# EAGLE design device_board (EAGLE 7.7.0)
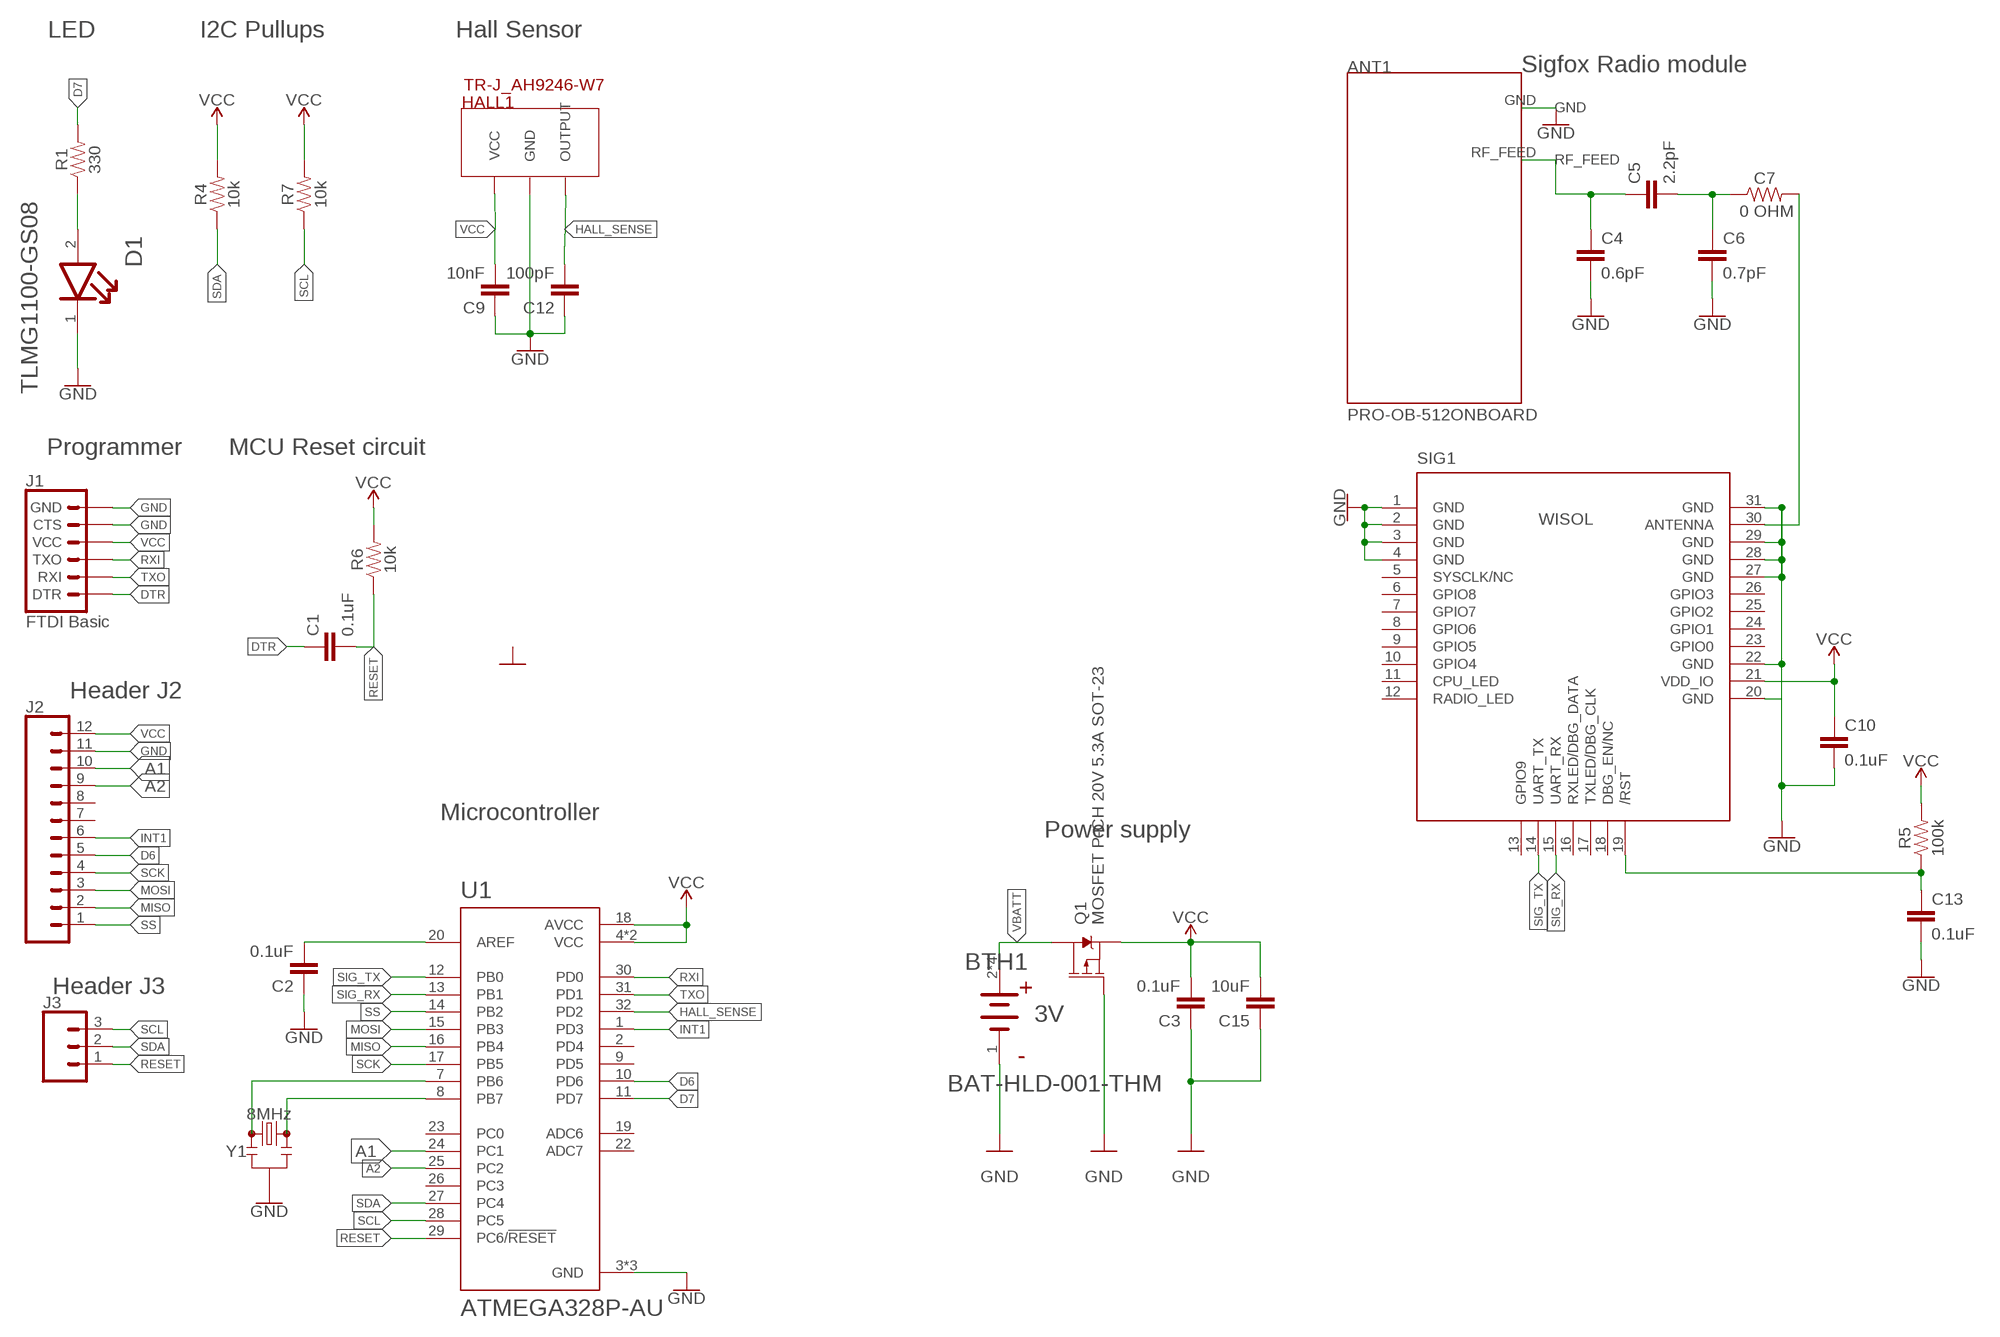
[diagram p0: schematic, sheet 1]

## Parts
ANT1  PRO-OB-512ONBOARD  [ONBOARD_SMD_2400]
BTH1  LINX_BAT-HLD-001-THMLINX_BAT-HLD-001-THM_0_0  [LINX_BAT-HLD-001-THM_0]
C1  0.1uF  0.1UF-0603-25V-5%  [0603]
C2  0.1uF  0.1UF-0603-25V-5%  [0603]
C3  0.1uF  0.1UF-0603-25V-5%  [0603]
C4  0.6pF  0.8PF-0402-50V-0.1PF  [0402]
C5  2.2pF  0.8PF-0402-50V-0.1PF  [0402]
C6  0.7pF  0.8PF-0402-50V-0.1PF  [0402]
C7  0 OHM  RESISTOR0402  [0402]
C9  10nF  10NF-0603-50V-10%  [0603]
C10  0.1uF  0.1UF-0603-25V-(+80/-20%)  [0603]
C12  100pF  100PF-0603-50V-5%  [0603]
C13  0.1uF  0.1UF-0603-25V-(+80/-20%)  [0603]
C15  10uF  10UF-0603-6.3V-20%  [0603]
D1  VISHAY_TLMG1100-GS08VISHAY_TLMG1100-GS08_0_0  [VISHAY_TLMG1100-GS08_0]
HALL1  TR-J_AH9246-W7  [TR-J_SC-59]
J1  FTDI Basic  6_PIN_SERIAL_TARGET  [1X06]
J2  CONN_12  [1X12]
J3  CONN_03  [1X03]
Q1  MOSFET P-CH 20V 5.3A SOT-23  MOSFET_PCHSI2323DDS  [SOT23-3]
R1  330  330OHM-0603-1/10W-1%  [0603]
R4  10k  10KOHM-0603-1/10W-1%  [0603]
R5  100k  100KOHM-0603-1/10W-1%  [0603]
R6  10k  10KOHM-0603-1/10W-1%  [0603]
R7  10k  10KOHM-0603-1/10W-1%  [0603]
SIG1  WISOL_WSSFM10HANDSOLDER  [WISOL_WSSFM10]
U1  ATMEGA328P-AU  [QFP80P900X900X120-32N]
Y1  8MHz  RESONATOR-8MHZSMD_3.2X1.3  [RESONATOR-SMD-3.2X1.3]

## Nets
A1: J2.10 U1.24(PC1)
A2: J2.9 U1.25(PC2)
D6: J2.5 U1.10(PD6)
D7: R1.2 U1.11(PD7)
DTR: C1.1 J1.1(DTR)
GND: ANT1.GND BTH1.1(CATHODE) C2.1 C3.1 C4.2 C6.2 C9.1 C10.2 C12.1 C13.2 C15.1 D1.1(CATHODE) HALL1.3(GND) J1.5(CTS) J1.6(GND) J2.11 Q1.1(G) SIG1.1(GND) SIG1.2(GND) SIG1.3(GND) SIG1.4(GND) SIG1.20(GND) SIG1.22(GND) SIG1.27(GND) SIG1.28(GND) SIG1.29(GND) SIG1.31(GND) U1.3(GND) U1.5(GND) U1.21(GND) Y1.2
HALL_SENSE: C12.2 HALL1.2(OUTPUT) U1.32(PD2)
INT1: J2.6 U1.1(PD3)
MISO: J2.2 U1.16(PB4)
MOSI: J2.3 U1.15(PB3)
N$1: C2.2 U1.20(AREF)
N$2: U1.7(PB6) Y1.1
N$3: U1.8(PB7) Y1.3
N$5: C13.1 R5.1 SIG1.19(/RST)
N$6: C7.2 SIG1.30(ANTENNA)
N$7: C5.2 C6.1 C7.1
N$9: ANT1.RF_FEED C4.1 C5.1
N$19: D1.2(ANODE) R1.1
RESET: C1.2 J3.1 R6.1 U1.29(PC6/!RESET)
RXI: J1.3(TXO) U1.30(PD0)
SCK: J2.4 U1.17(PB5)
SCL: J3.3 R7.1 U1.28(PC5)
SDA: J3.2 R4.1 U1.27(PC4)
SIG_RX: SIG1.15(UART_RX) U1.13(PB1)
SIG_TX: SIG1.14(UART_TX) U1.12(PB0)
SS: J2.1 U1.14(PB2)
TXO: J1.2(RXI) U1.31(PD1)
VBATT: BTH1.2(ANODE) BTH1.2-2(ANODE) BTH1.2-3(ANODE) BTH1.2-4(ANODE) Q1.3(D)
VCC: C3.2 C9.2 C10.1 C15.2 HALL1.1(VCC) J1.4(VCC) J2.12 Q1.2(S) R4.2 R5.2 R6.2 R7.2 SIG1.21(VDD_IO) U1.4(VCC) U1.6(VCC) U1.18(AVCC)
Unconnected: J2.7 J2.8 SIG1.5(SYSCLK/NC) SIG1.6(GPIO8) SIG1.7(GPIO7) SIG1.8(GPIO6) SIG1.9(GPIO5) SIG1.10(GPIO4) SIG1.11(CPU_LED) SIG1.12(RADIO_LED) SIG1.13(GPIO9) SIG1.16(RXLED/DBG_DATA) SIG1.17(TXLED/DBG_CLK) SIG1.18(DBG_EN/NC) SIG1.23(GPIO0) SIG1.24(GPIO1) SIG1.25(GPIO2) SIG1.26(GPIO3) U1.2(PD4) U1.9(PD5) U1.19(ADC6) U1.22(ADC7) U1.23(PC0) U1.26(PC3)

## Notes on the sheet
- LED | Hall Sensor
- I2C Pullups
- Sigfox Radio module
- Programmer | MCU Reset circuit
- Header J2
- Microcontroller
- Power supply
- Header J3

## Library data of the parts
ANT1 = proant:PRO-OB-512: Proant OnBoard Antenna PRO-OB-512 for 848/2400MHz comms (e.g. SigFox)
BTH1 = Linx - BAT-HLD-001-THM:LINX_BAT-HLD-001-THM: RETAINER BATT CR2025/2032 PC PIN; CENTROID_NOT_SPECIFIED: No; DATASHEET: https://www.linxtechnologies.com/wp/wp-content/uploads/bat-hld-001-thm.pdf; DIGIKEY_DESCRIPTION: BATT RETAINER BATT CR2025/2032 PC PIN; DIGIKEY_PART_NUMBER: BAT-HLD-001-THM-ND; LEAD_FREE: yes; MF: Linx; MFG_PACKAGE_IDENT: BAT-HLD-001-THM; MOUSER_PART_NUMBER: 712-BAT-HLD-001-THM; MPN: BAT-HLD-001-THM; PACKAGE: BT-HOLDER; PREFIX: BT; ROHS: yes; VOLTAGE: 3V
C1-C3 = SparkFun-Capacitors:0.1UF: 0.1µF ceramic capacitors A capacitor is a passive two-terminal electrical component used to store electrical energy temporarily in an electric field.; PROD_ID: CAP-08604
C4-C6 = SparkFun-Capacitors:0.8PF: 0.8pF ceramic capacitors A capacitor is a passive two-terminal electrical component used to store electrical energy temporarily in an electric field.; PROD_ID: CAP-13456; VALUE: 0.8pF
C7 = SparkFun-Resistors:RESISTOR: Generic Resistor Package
C9 = SparkFun-Capacitors:10NF: 0.01uF/10nF/10,000pF ceramic capacitors A capacitor is a passive two-terminal electrical component used to store electrical energy temporarily in an electric field. CAP-09321; PROD_ID: CAP-00867
C10 C13 = SparkFun-Capacitors:0.1UF: 0.1µF ceramic capacitors A capacitor is a passive two-terminal electrical component used to store electrical energy temporarily in an electric field.; PROD_ID: CAP-00810
C12 = SparkFun-Capacitors:100PF: 100pF/0.1nF ceramic capacitors A capacitor is a passive two-terminal electrical component used to store electrical energy temporarily in an electric field.; PROD_ID: CAP-07883
C15 = SparkFun-Capacitors:10UF: 10.0µF ceramic capacitors A capacitor is a passive two-terminal electrical component used to store electrical energy temporarily in an electric field.; PROD_ID: CAP-11015
D1 = Vishay - TLMG1100-GS08:VISHAY_TLMG1100-GS08: LED GREEN 0603 SMD; CENTROID_NOT_SPECIFIED: No; COLOUR: Green; DATASHEET: http://www.vishay.com/docs/83173/tlmb1100.pdf; DEVICE_CLASS_L1: Optoelectronics; DEVICE_CLASS_L2: LEDs; DEVICE_CLASS_L3: unset; DIGIKEY_DESCRIPTION: DIODE LED GREEN 0603 SMD; DIGIKEY_PART_NUMBER: 751-1165-1-ND; FORWARD_CURRENT: 30mA; FORWARD_VOLTAGE: 2.1V; HEIGHT: 0.65mm; LEAD_FREE: yes; LED_ORIENTATION: Top View; LUMINOUS_INTENSITY: 35mcd; MAX_JUNCTION_TEMP: +120°C; MF: Vishay; MFG_PACKAGE_IDENT: TLMG0603; MFG_PACKAGE_IDENT_DATE: 0; MFG_PACKAGE_IDENT_REV: 0; MOUSER_DESCRIPTION: Standard LEDs - SMD Green Non-Diffused; MOUSER_PART_NUMBER: 78-TLMG1100; MPN: TLMG1100-GS08; PACKAGE: 0603; POWER_DISSIPATION: 90mW; PREFIX: D; REVERSE_VOLTAGE: 6V; ROHS: yes; TEMPERATURE_RANGE_HIGH: +100°C; TEMPERATURE_RANGE_LOW: -40°C; VERIFICATION_VERSION: 0.0.0.1; VIEWING_ANGLE: 160°; WAVELENGTH: 570nm
HALL1 = Siguino:TR-J_AH9246-W7: Hall effect switch, surface mount, part number AH9246-W-7
J1 = SparkFun-Connectors:6_PIN_SERIAL_TARGET: 6-pin header connection for use with the "FTDI BASIC" pinout - TARGET SIDE. Also known as "Arduino Serial Program Header". It is used to mate with our FTDI Basic serial programmers using the Arduino IDE. Note, this device has "TARGET" in the name. It is intended to be used on a design that contains a target micro-controller that you wish to program. The "sister" device, named "CABLE" is inteneded to be used on a design that usually lives on the end of your USB cable and prvides the converter chip (FTDI232 or FTDI231x) to commnicate serial RX/TX. You can populate with some of these: Break Away Headers - Straight <https://www.sparkfun.com/products/116> (PRT-00116) For reference (or to suit your programming needs) check out these designs: SparkFun FTDI Basic Breakout - 5V <https://www.sparkfun.com/products/9716> (DEV-09716) SparkFun FTDI Basic Breakout - 3.3V <https://www.sparkfun.com/products/9873> (DEV-09873) SparkFun FTDI SmartBasic <https://www.sparkfun.com/products/12935> (DEV-12935) SparkFun Beefy 3 - FTDI Basic Breakout <https://www.sparkfun.com/products/13746> (DEV-13746)
J2 = SparkFun-Connectors:CONN_12: Multi connection point. Often used as Generic Header-pin footprint for 0.1 inch spaced/style header connections On any of the 0.1 inch spaced packages, you can populate with these: Break Away Headers - Straight <https://www.sparkfun.com/products/116> (PRT-00116) Break Away Male Headers - Right Angle <https://www.sparkfun.com/products/553> (PRT-00553) Female Headers <https://www.sparkfun.com/products/115> (PRT-00115) Break Away Headers - Machine Pin <https://www.sparkfun.com/products/117> (PRT-00117) Break Away Female Headers - Swiss Machine Pin <https://www.sparkfun.com/products/743> (PRT-00743) For SCREWTERMINALS and SPRING TERMINALS visit here: Screw Terimnals on SparkFun.com <https://www.sparkfun.com/search/results?term=Screw+Terminals> (5mm/3.5mm/2.54mm spacing) This device is also useful as a general connection point to wire up your design to another part of your project. Our various solder wires solder well into these plated through hole pads. Hook-Up Wire - Assortment (Stranded, 22 AWG) <https://www.sparkfun.com/products/11375> (PRT-11375) Hook-Up Wire - Assortment (Solid Core, 22 AWG) <https://www.sparkfun.com/products/11367> (PRT-11367) View the entire wire category on our website here <https://www.sparkfun.com/categories/141> Special notes: Molex polarized connector foot print use with SKU : PRT-08231 with associated crimp pins and housings. 1MM SMD Version SKU: PRT-10208 NOTES ON THE VARIANTS LOCK and LOCK_LONGPADS... This footprint was designed to help hold the alignment of a through-hole component (i.e. 6-pin header) while soldering it into place. You may notice that each hole has been shifted either up or down by 0.005 of an inch from it's more standard position (which is a perfectly straight line). This slight alteration caused the pins (the squares in the middle) to touch the edges of the holes. Because they are alternating, it causes a "brace" to hold the component in place. 0.005 has proven to be the perfect amount of "off-center" position when using our standard breakaway headers. Although looks a little odd when you look at the bare footprint, once you have a header in there, the alteration is very hard to notice. Also,if you push a header all the way into place, it is covered up entirely on the bottom side.
J3 = SparkFun-Connectors:CONN_03: Multi connection point. Often used as Generic Header-pin footprint for 0.1 inch spaced/style header connections On any of the 0.1 inch spaced packages, you can populate with these: Break Away Headers - Straight <https://www.sparkfun.com/products/116> (PRT-00116) Break Away Male Headers - Right Angle <https://www.sparkfun.com/products/553> (PRT-00553) Female Headers <https://www.sparkfun.com/products/115> (PRT-00115) Break Away Headers - Machine Pin <https://www.sparkfun.com/products/117> (PRT-00117) Break Away Female Headers - Swiss Machine Pin <https://www.sparkfun.com/products/743> (PRT-00743) Stackable Header - 3 Pin (Female, 0.1") <https://www.sparkfun.com/products/13875> (PRT-13875) For SCREWTERMINALS and SPRING TERMINALS visit here: Screw Terimnals on SparkFun.com <https://www.sparkfun.com/search/results?term=Screw+Terminals> (5mm/3.5mm/2.54mm spacing) This device is also useful as a general connection point to wire up your design to another part of your project. Our various solder wires solder well into these plated through hole pads. Hook-Up Wire - Assortment (Stranded, 22 AWG) <https://www.sparkfun.com/products/11375> (PRT-11375) Hook-Up Wire - Assortment (Solid Core, 22 AWG) <https://www.sparkfun.com/products/11367> (PRT-11367) View the entire wire category on our website here <https://www.sparkfun.com/categories/141> Special notes: Molex polarized connector foot print use with SKU : PRT-08232 with associated crimp pins and housings.
Q1 = SparkFun-DiscreteSemi:MOSFET_PCH: P-channel MOSFETs Voltage controlled devices that allow control of high current outputs E.g. See Digikey Product here: SI2323DDS-T1-GE3 <https://www.digikey.ie/product-detail/en/vishay-siliconix/SI2323DDS-T1-GE3/SI2323DDS-T1-GE3CT-ND/4142086>; PROD_ID: SI2323DDS-T1-GE3
R1 = SparkFun-Resistors:330OHM: 330Ω resistor A resistor is a passive two-terminal electrical component that implements electrical resistance as a circuit element. Resistors act to reduce current flow, and, at the same time, act to lower voltage levels within circuits. - Wikipedia; PROD_ID: RES-00818
R4 R6 R7 = SparkFun-Resistors:10KOHM: 10kΩ resistor A resistor is a passive two-terminal electrical component that implements electrical resistance as a circuit element. Resistors act to reduce current flow, and, at the same time, act to lower voltage levels within circuits. - Wikipedia; PROD_ID: RES-00824
R5 = SparkFun-Resistors:100KOHM: 100kΩ resistor A resistor is a passive two-terminal electrical component that implements electrical resistance as a circuit element. Resistors act to reduce current flow, and, at the same time, act to lower voltage levels within circuits. - Wikipedia; PROD_ID: RES-07828
SIG1 = Siguino:WISOL_WSSFM10: WiSOL WSSFM10 Sigfox Module with PCB Footprint to enable handsolder
U1 = ATMEGA328P-AU:ATMEGA328P-AU: ATmega Series 20 MHz 32 KB Flash 2 KB SRAM 8-Bit Microcontroller - TQFP-32; AVAILABILITY: Unavailable; DESCRIPTION: Microcontroller Mcu, 8 Bit, Atmega, 20mhz, Tqfp-32; MF: Microchip; MP: ATMEGA328P-AU; PACKAGE: TQFP-32 Microchip; PRICE: None
Y1 = SparkFun-Clocks:RESONATOR-8MHZ: 8MHz Resonator Digikey Example <http://www.digikey.com/product-detail/en/murata-electronics-north-america/CSTCE10M0G55-R0/490-1196-1-ND/584633> Frequency: 8MHz Frequency Stability: ±0.2% Frequency Tolerance: ±0.5% Capacitance: 33pF SparkFun Products Arduino Pro Mini 328- 3.3V/8MHz <https://www.sparkfun.com/products/11114> SparkFun Digital Sandbox <https://www.sparkfun.com/products/12651>; PROD_ID: XTAL-08895

## Board
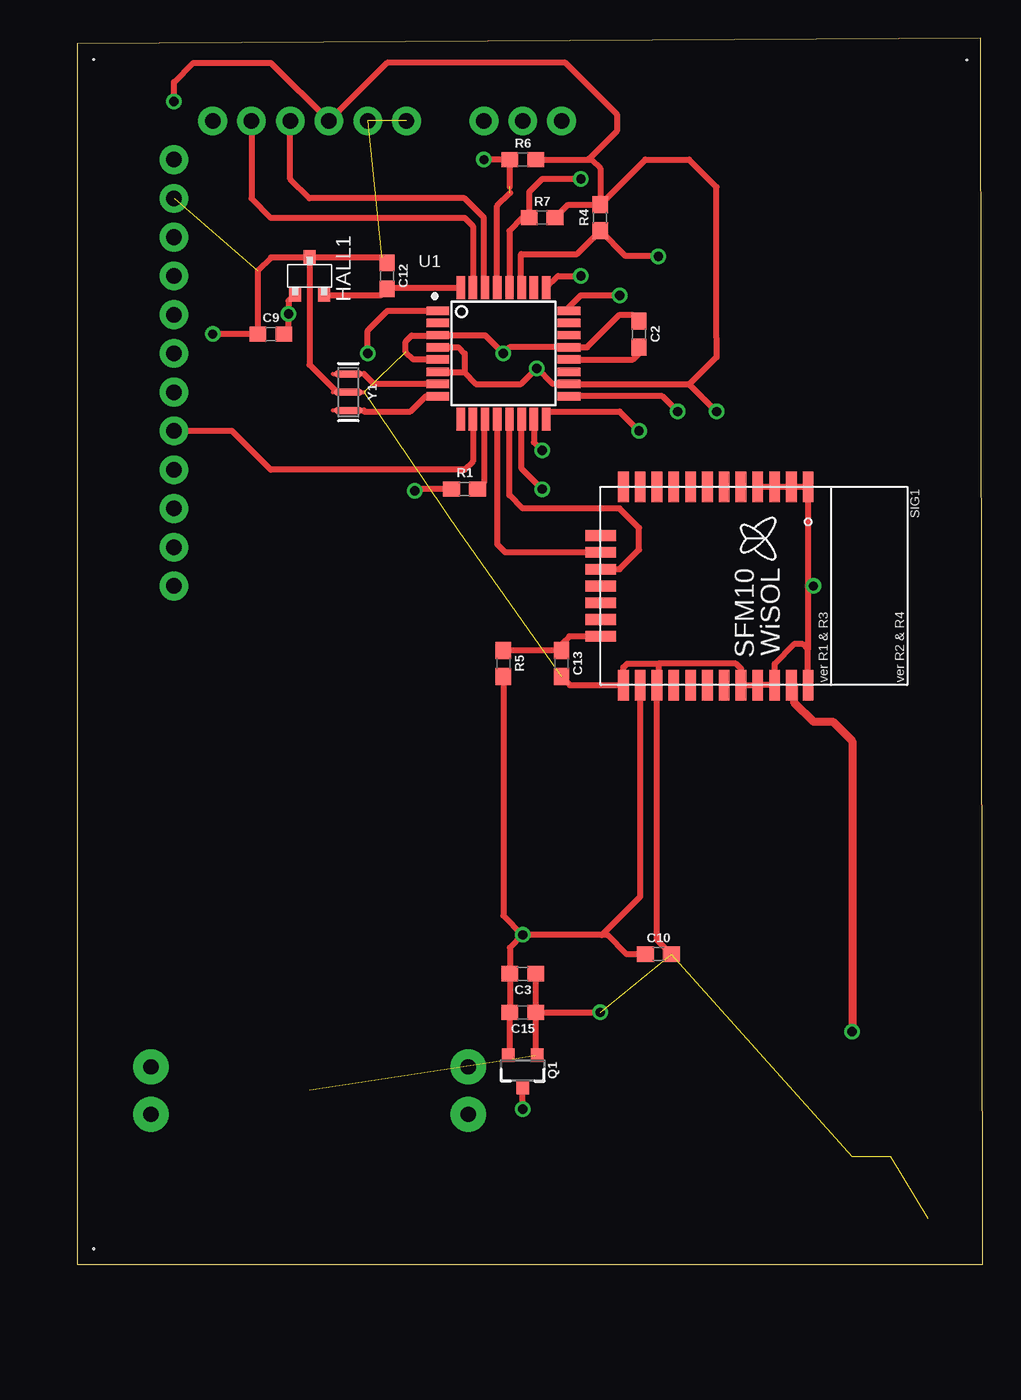
[diagram p1: board, top side]
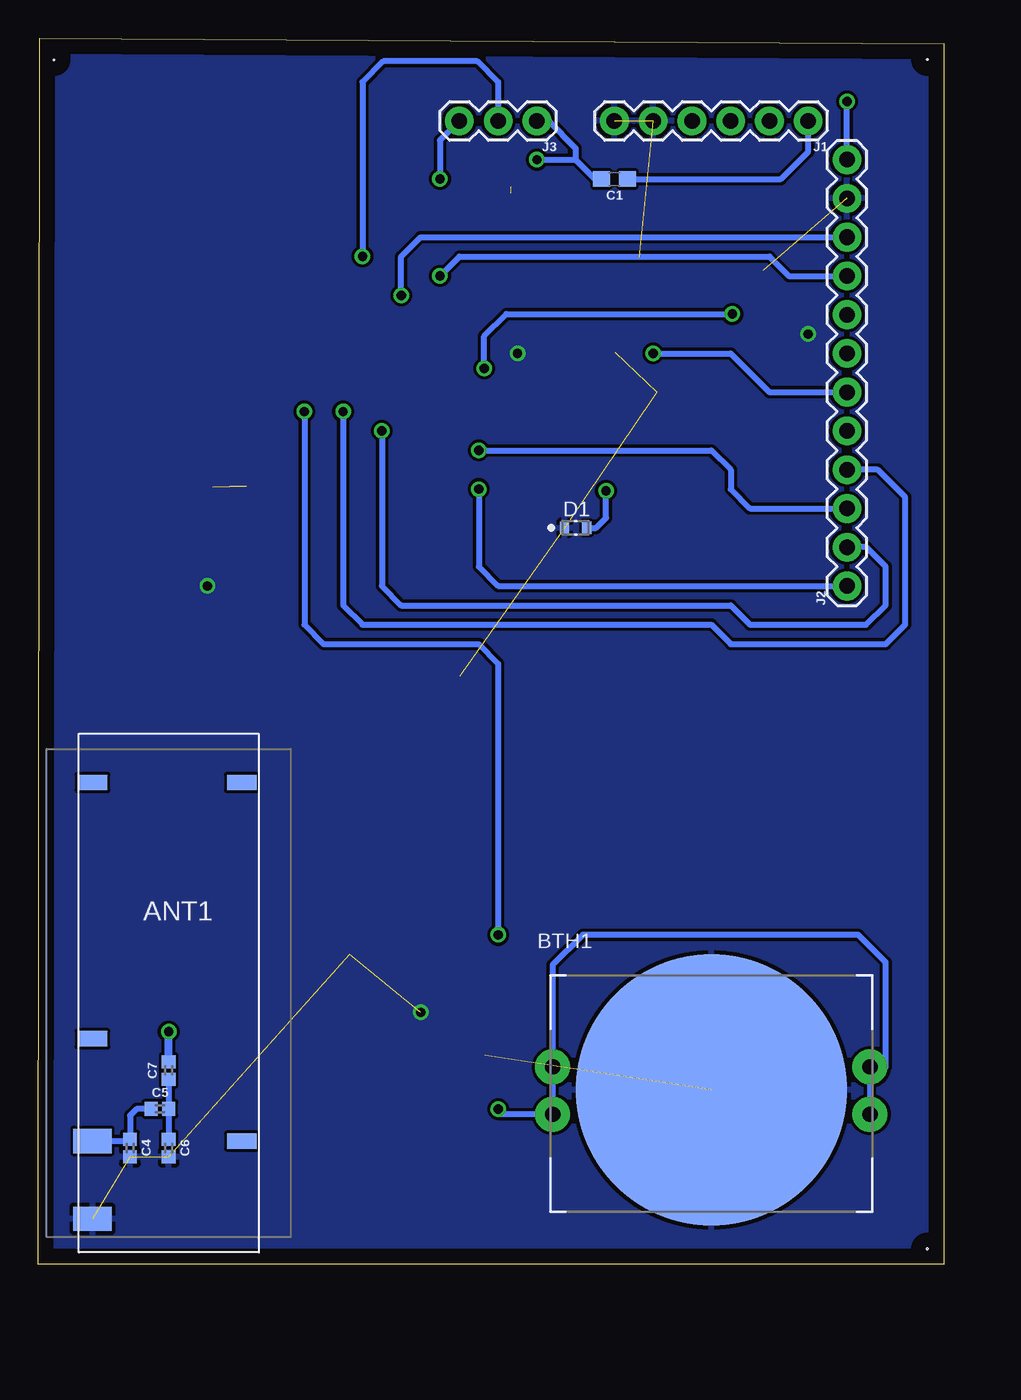
[diagram p2: board, bottom side, seen from below]

Size 59.36 x 80.35 mm. Coordinates in mm from the lower left corner, seen from the top.
Outline: 0,80 0,0 59.36,0 59.24,80.35 0,80
Copper layers (1*16): Top 0.035mm / dielectric 1.5mm / Bottom 0.035mm
Design rules "default": minimum track width 10mil, minimum drill 24mil, track to track 8mil, track to pad 8mil, pad to pad 8mil, via to via 8mil, smd to smd 8mil, copper to edge 40mil, drill to drill 8mil, minimum pad ring 10mil, minimum via ring 8mil, stop-mask expansion 4mil, vias tented up to drill 0mil, thermal gap 10mil
Holes 0.08 mm at 1.09,78.95 58.32,78.93 1.09,1.01

### Footprints (pad centres in the part's own frame; a part is rotated, then mirrored left to right if it is on the bottom)
ONBOARD_SMD_2400 = smd 2.5 x 1.6: GND 5,14.8; RF_FEED 5,9.7 | smd 1.95 x 1: NC$1 -4.8,9.7; NC$2 5,3; NC$3 5,-13.8; NC$4 -4.8,-13.8
LINX_BAT-HLD-001-THM_0 = smd 17.8 x 17.8: 1 0,0 | drill 1 pad 2.3: 2 -10.4,1.5; 2-2 -10.4,-1.6; 2-3 10.4,-1.6; 2-4 10.4,1.5
0603 = smd 1.1 x 1: 1 -0.85,0; 2 0.85,0
0402 = smd 0.85 x 0.9: 1 -0.58,0; 2 0.58,0
VISHAY_TLMG1100-GS08_0 = smd 0.6 x 0.8: 1 -0.725,0; 2 0.725,0
TR-J_SC-59 = smd 0.8 x 1: 1 -0.95,-1.2; 2 0.95,-1.2; 3 0,1.2
1X06 = drill 1.016 pad 1.88: 1 0,0; 2 2.54,0; 3 5.08,0; 4 7.62,0; 5 10.16,0; 6 12.7,0
1X12 = drill 1.016 pad 1.88: 1 0,0; 2 2.54,0; 3 5.08,0; 4 7.62,0; 5 10.16,0; 6 12.7,0; 7 15.24,0; 8 17.78,0; 9 20.32,0; 10 22.86,0; 11 25.4,0; 12 27.94,0
1X03 = drill 1.016 pad 1.88: 1 0,0; 2 2.54,0; 3 5.08,0
SOT23-3 = smd 0.8 x 0.9: 1 -0.95,-1; 2 0.95,-1; 3 0,1.1
WISOL_WSSFM10 = smd 2 x 0.7: 1 -6.5,6; 2 -6.5,4.9; 3 -6.5,3.8; 4 -6.5,2.7; 5 -6.5,1.6; 6 -6.5,0.5; 7 -6.5,-0.6; 8 -6.5,-1.7; 9 -6.5,-2.8; 10 -6.5,-3.9; 11 -6.5,-5; 12 -6.5,-6.1; 20 6.5,-6.1; 21 6.5,-5; 22 6.5,-3.9; 23 6.5,-2.8; 24 6.5,-1.7; 25 6.5,-0.6; 26 6.5,0.5; 27 6.5,1.6; 28 6.5,2.7; 29 6.5,3.8; 30 6.5,4.9; 31 6.5,6 | smd 0.7 x 2: 13 -3.3,-7.6; 14 -2.2,-7.6; 15 -1.1,-7.6; 16 0,-7.6; 17 1.1,-7.6; 18 2.2,-7.6; 19 3.3,-7.6
QFP80P900X900X120-32N = smd 1.5 x 0.55: 1 -4.3,2.8; 2 -4.3,2; 3 -4.3,1.2; 4 -4.3,0.4; 5 -4.3,-0.4; 6 -4.3,-1.2; 7 -4.3,-2; 8 -4.3,-2.8; 17 4.3,-2.8; 18 4.3,-2; 19 4.3,-1.2; 20 4.3,-0.4; 21 4.3,0.4; 22 4.3,1.2; 23 4.3,2; 24 4.3,2.8 | smd 0.55 x 1.5: 9 -2.8,-4.3; 10 -2,-4.3; 11 -1.2,-4.3; 12 -0.4,-4.3; 13 0.4,-4.3; 14 1.2,-4.3; 15 2,-4.3; 16 2.8,-4.3; 25 2.8,4.3; 26 2,4.3; 27 1.2,4.3; 28 0.4,4.3; 29 -0.4,4.3; 30 -1.2,4.3; 31 -2,4.3; 32 -2.8,4.3
RESONATOR-SMD-3.2X1.3 = smd 0.45 x 1.905: 1 -1.2,0; 2 0,0; 3 1.2,0

### Placement (x,y rotation side)
ANT1  50.8,17.78 180 bottom
BTH1  15.24,11.43 0 bottom
C1  21.59,71.12 180 bottom
C2  36.83,60.96 270 top
C3  29.21,19.05 180 top
C4  53.34,7.62 270 bottom
C5  51.38,10.18 0 bottom
C6  50.8,7.62 270 bottom
C7  50.8,12.7 90 bottom
C9  12.7,60.96 0 top
C10  38.1,20.32 0 top
C12  20.32,64.77 270 top
C13  31.75,39.37 270 top
C15  29.21,16.51 180 top
D1  24.13,48.26 0 bottom
HALL1  15.24,64.77 0 top
J1  8.89,74.93 180 bottom
J2  6.35,44.45 90 bottom
J3  26.67,74.93 180 bottom
Q1  29.21,12.7 180 top
R1  25.4,50.8 0 top
R4  34.29,68.58 90 top
R5  27.94,39.37 270 top
R6  29.21,72.39 0 top
R7  30.48,68.58 0 top
SIG1  41.91,44.45 270 top
U1  27.94,59.69 0 top
Y1  17.78,57.15 270 top

### Tracks (layer width: path | path; a pad name or v marks a point on that pad's centre or on a via)
A1  (via drill 0.61)
  Top 0.406: U1.24 32.24,62.72 33.02,63.5 v35.56,63.5
  Bottom 0.406: v35.56,63.5 35.56,66.04 34.29,67.31 J2.10
A2  (via drill 0.61)
  Top 0.406: U1.25 31.52,64.77 v33.02,64.77
  Bottom 0.406: v33.02,64.77 31.75,66.04 11.43,66.04 10.16,64.77 J2.9
D6
  Top 0.406: U1.10 25.94,52.61 25.4,52.07 12.7,52.07 10.16,54.61 J2.5
D7
  Top 0.406: U1.11 26.67,55.39 26.67,51.22 R1.2
DTR
  Bottom 0.406: C1.1 10.69,71.12 8.89,72.92 J1.1
GND  (via drill 0.61)  (13 unrouted)
  Top 0.406: C13.2 32,38.52 32,38.24 32.29,37.95 SIG1.20 35.81,39.12 36.06,39.37 38.1,39.37 | HALL1.3 12.7,65.97 11.85,65.12 C9.1 v8.89,60.96 | HALL1.3 15.24,58.95 17.04,57.15 Y1.2 | U1.3 26.74,60.89 v27.94,59.69 28.34,60.09 U1.21 33.42,60.09 35.56,62.23 36.41,62.23 C2.1 | 43.51,37.68 SIG1.27 | SIG1.4 SIG1.1 47.91,44.45 | SIG1.27 SIG1.28 SIG1.29 45.72,39.37 46.99,40.64 47.56,40.64 47.91,40.29 | SIG1.31 47.91,40.29 | C3.1 C15.1 | C15.1 30.06,13.7 Q1.1 | C15.1 v34.29,16.51 | 38.1,39.37 38.1,37.95 SIG1.22 38.01,21.26 C10.2 | SIG1.27 43.51,39.04 43.18,39.37 38.1,39.37 | 47.91,44.45 v48.26,44.45 | C12.1 19.97,65.97 HALL1.3 | 23.64,60.96 U1.3 | 47.91,44.45 47.91,40.29 | U1.5 22.04,59.29 21.55,59.78 21.55,60.47 21.93,60.86 23.64,60.86 U1.3
  pour Bottom: 0,80.01 58.89,80.13 59.36,0.1 0.12,-0.02
HALL_SENSE
  Top 0.406: HALL1.2 16.26,63.5 19.9,63.5 C12.2 20.32,63.99 U1.32
INT1  (via drill 0.61)
  Top 0.406: v19.05,59.69 19.05,61.19 20.35,62.49 U1.1
  Bottom 0.406: v19.05,59.69 13.97,59.69 11.43,57.15 J2.6
MISO  (via drill 0.61)
  Top 0.406: U1.16 30.74,55.88 35.56,55.88 v36.83,54.61
  Bottom 0.406: v36.83,54.61 36.83,44.45 35.56,43.18 13.97,43.18 12.7,41.91 5.08,41.91 3.81,43.18 3.81,45.72 5.08,46.99 J2.2
MOSI  (via drill 0.61)
  Top 0.406: U1.15 29.94,53.88 v30.48,53.34
  Bottom 0.406: v30.48,53.34 15.24,53.34 13.97,52.07 13.97,50.8 12.7,49.53 J2.3
N$1
  Top 0.406: U1.20 36.43,59.29 36.83,59.69 C2.2
N$2
  Top 0.406: U1.7 19.46,57.69 18.8,58.35
N$3
  Top 0.406: 18.8,55.95 18.8,55.88 21.85,55.88 22.86,56.89 U1.8
N$5
  Top 0.406: SIG1.19 32.26,41.15 31.75,40.64 C13.1 R5.1
N$6  (via drill 0.61)
  Top 0.406: SIG1.30 46.99,37.95
  Top 0.508: 46.99,37.95 46.99,36.83 48.26,35.56 49.53,35.56 50.8,34.29 v50.8,15.24
  Bottom 0.508: C7.2 v50.8,15.24
N$7
  Bottom 0.406: C7.1 C5.2 C6.1
N$9
  Bottom 0.406: ANT1.RF_FEED 53.34,8.08 C4.1 53.34,9.75 52.91,10.18 C5.1
N$19  (via drill 0.61)
  Top 0.406: 24.86,50.49 R1.1 22.14,50.8 v22.14,50.68
  Bottom 0.406: D1.2 22.8,48.26 22.14,48.92 v22.14,50.68
RESET  (via drill 0.61)  (1 unrouted)
  Top 0.406: v26.67,72.39 R6.1 28.36,70.6 | U1.29 27.54,69.36 28.38,70.21
  Bottom 0.406: C1.2 22.86,71.12 24.13,72.39 | v26.67,72.39 24.13,72.39 | J3.1 25.93,74.93 24.13,73.13 24.13,72.39
RXI
  Top 0.406: U1.30 26.67,63.99 26.67,68.58 25.4,69.85 15.24,69.85 13.97,71.12 J1.3
SCK  (via drill 0.61)
  Top 0.406: v39.37,55.88 38.36,56.89 U1.17
  Bottom 0.406: v39.37,55.88 39.37,43.18 38.1,41.91 15.24,41.91 13.97,40.64 3.81,40.64 2.54,41.91 2.54,50.27 4.34,52.07 J2.4
SCL  (via drill 0.61)
  Top 0.406: U1.28 28.34,67.71 29.21,68.58 R7.1 29.63,70.27 30.48,71.12 v33.02,71.12
  Bottom 0.406: J3.3 33.02,73.66 v33.02,71.12
SDA  (via drill 0.61)
  Top 0.406: 29.21,63.99 U1.27 29.11,63.99 29.11,66.21 32.77,66.21 R4.1 35.94,66.08 38.1,66.08 v38.1,66.04
  Bottom 0.406: J3.2 29.21,77.47 30.57,78.83 36.74,78.83 38.1,77.47 v38.1,66.04
SIG_RX
  Top 0.406: SIG1.15 35.55,45.55 36.83,46.83 36.83,48.26 35.56,49.53 29.21,49.53 28.34,50.4 U1.13
SIG_TX
  Top 0.406: SIG1.14 28.07,46.65 27.54,47.17 U1.12
SS  (via drill 0.61)
  Top 0.406: v30.48,50.8 29.14,52.14 U1.14
  Bottom 0.406: v30.48,50.8 30.48,45.72 29.21,44.45 J2.1
TXO
  Top 0.406: J1.2 11.43,69.85 12.7,68.58 25.4,68.58 25.94,68.04 U1.31
VBATT  (via drill 0.61)
  Top 0.406: v29.21,10.16 Q1.3
  Bottom 0.406: BTH1.2-3 BTH1.2-4 3.81,12.93 3.81,19.79 5.61,21.59 23.67,21.59 25.64,19.62 BTH1.2 BTH1.2-2 29.07,9.83 29.21,9.96 v29.21,10.16
VCC  (via drill 0.61)
  Top 0.406: U1.4 25,60.09 25.4,59.69 25.4,58.42 | 25.4,58.42 23.64,58.42 U1.6 | 25.4,58.42 26.13,57.69 29.1,57.69 v30.13,58.72 31.16,57.69 U1.18 40.1,57.69 | R4.2 37.25,72.39 40.11,72.39 41.91,70.59 41.91,60.69 41.9,60.69 41.9,59.44 40.1,57.64 40.1,57.69 | v6.35,76.2 6.35,77.47 7.62,78.74 12.7,78.74 J1.4 20.32,78.74 32.02,78.74 35.38,75.38 35.38,74.26 33.57,72.46 33.57,72.39 | R5.2 27.94,22.86 v29.21,21.59 | R7.2 32.18,69.43 R4.2 | Q1.2 28.36,13.7 C15.2 C3.2 28.36,20.74 v29.21,21.59 | C9.2 13.86,61.27 v13.86,62.27 13.86,63.14 HALL1.1 | R6.2 33.57,72.39 | 33.57,72.39 33.73,72.39 34.29,71.83 R4.2 | 40.1,57.69 v41.91,55.88 | C10.1 36.01,20.32 34.76,21.58 34.37,21.58 | 34.37,21.58 29.21,21.58 v29.21,21.59 | SIG1.21 36.9,24.09 34.37,21.55 34.37,21.58
  Bottom 0.406: J2.12 v6.35,76.2 | v41.91,55.88 41.91,41.91 40.64,40.64 30.48,40.64 29.21,39.37 v29.21,21.59 | v13.86,62.27 28.68,62.27 30.13,60.82 v30.13,58.72